# Altium project 新电磁.PrjPCB
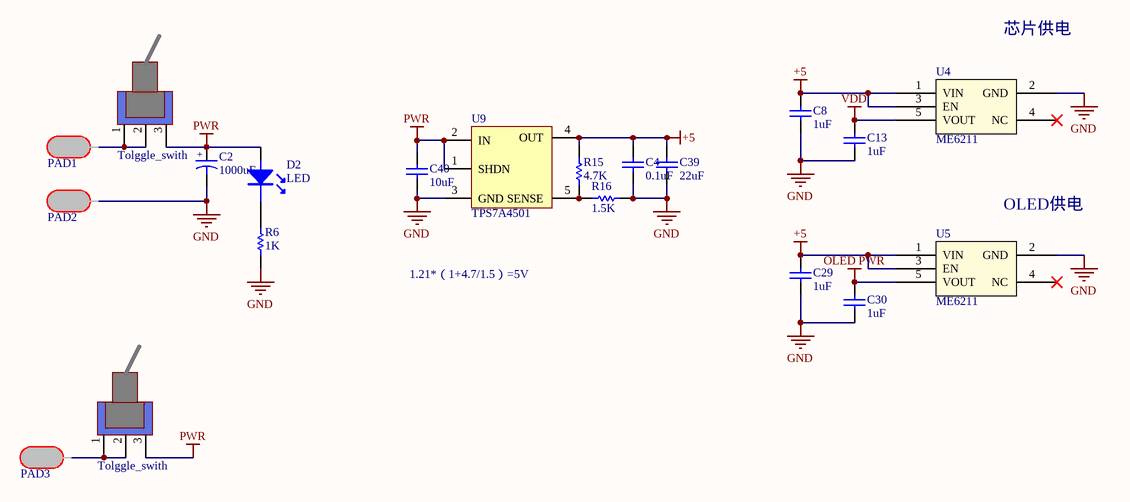
[diagram p0: 电源.SchDoc]
2 sheets, 43 parts. Net scope: global (net labels, ports and power ports of the same name join across sheets).
Board file: PCB1.PcbDoc
Sheets:
  电源.SchDoc
  外设.SchDoc

## Sheet 电源.SchDoc
size A4

### Parts
C2  1000uF  [CAP 10 x 12]
C4  0.1uF  [0603_C]
C8  1uF  [0805_c]
C13  1uF  [0805_c]
C29  1uF  [0805_c]
C30  1uF  [0805_c]
C39  22uF  [0805_c]
C40  10uF  [0805_c]
D2  LED  [0603_LED]
Energy1  Tolggle_swith  [TOGGLE SWICH STAND]
Energy2  Tolggle_swith  [TOGGLE SWICH STAND]
PAD1  PAD  [BIG PAD]  (value not drawn)
PAD2  PAD  [BIG PAD]  (value not drawn)
PAD3  PAD  [BIG PAD]  (value not drawn)
R6  1K  [R0603]
R15  4.7K  [R0603]
R16  1.5K  [R0603]
U4  ME6211  [SOT23-5]
U5  ME6211  [SOT23-5]
U9  TPS7A4501  [SOT-6]

### Nets
+5: C4.2 C8.2 C29.2 C39.2 R15.2 U4.1(VIN) U4.3(EN) U5.1(VIN) U5.3(EN) U9.4(OUT)
GND: C2.2 C4.1 C8.1 C13.1 C29.1 C30.1 C39.1 C40.1 PAD2.1 R6.1 R16.2 U4.2(GND) U5.2(GND) U9.3(GND)
OLED PWR: C30.2 U5.5(VOUT)
PWR: C2.1 C40.2 D2.1(A) Energy1.3 Energy2.3 U9.1(SHDN) U9.2(IN)
VDD: C13.2 U4.5(VOUT)
NetD2_2: D2.2(K) R6.2
NetEnergy1_1: Energy1.1 Energy1.2 PAD1.1
NetEnergy2_1: Energy2.1 Energy2.2 PAD3.1
NetR15_1: R15.1 R16.1 U9.5(SENSE)

Not connected (* = marked no-connect by the designer): U4 4(NC)*; U5 4(NC)*

### Notes on the sheet
- 芯片供电
- (near U5) OLED供电
- 1.21*（1+4.7/1.5）=5V
- (in symbol Cap_polar) +

### Library data of the parts
C2 = Cap_polar
C4 C8 C13 C29 C30 C39 C40 = CAP: Capacitor; Value: 104; Published: 8-Jun-2000; LatestRevisionDate: 17-Jul-2002; LatestRevisionNote: Re-released for DXP Platform.; PackageReference: RAD-0.3; Publisher: Altium Limited
D2 = LED: LED 发光二极管
R6 = RES: Resistor; Published: 8-Jun-2000; Revision: July-2002: Re-released for DXP Platform.; Publisher: Altium Limited; Value: 1K
R15 R16 = RES: Resistor; Value: 1K; Published: 8-Jun-2000; Revision: July-2002: Re-released for DXP Platform.; Publisher: Altium Limited
U4 U5 = ADP150AUJZ-1_8-R: 9uVRMS 150mA LDO; RefDes: RefDes; Type: Type; Value: Value
U9 = TL1963A

## Sheet 外设.SchDoc
size A4
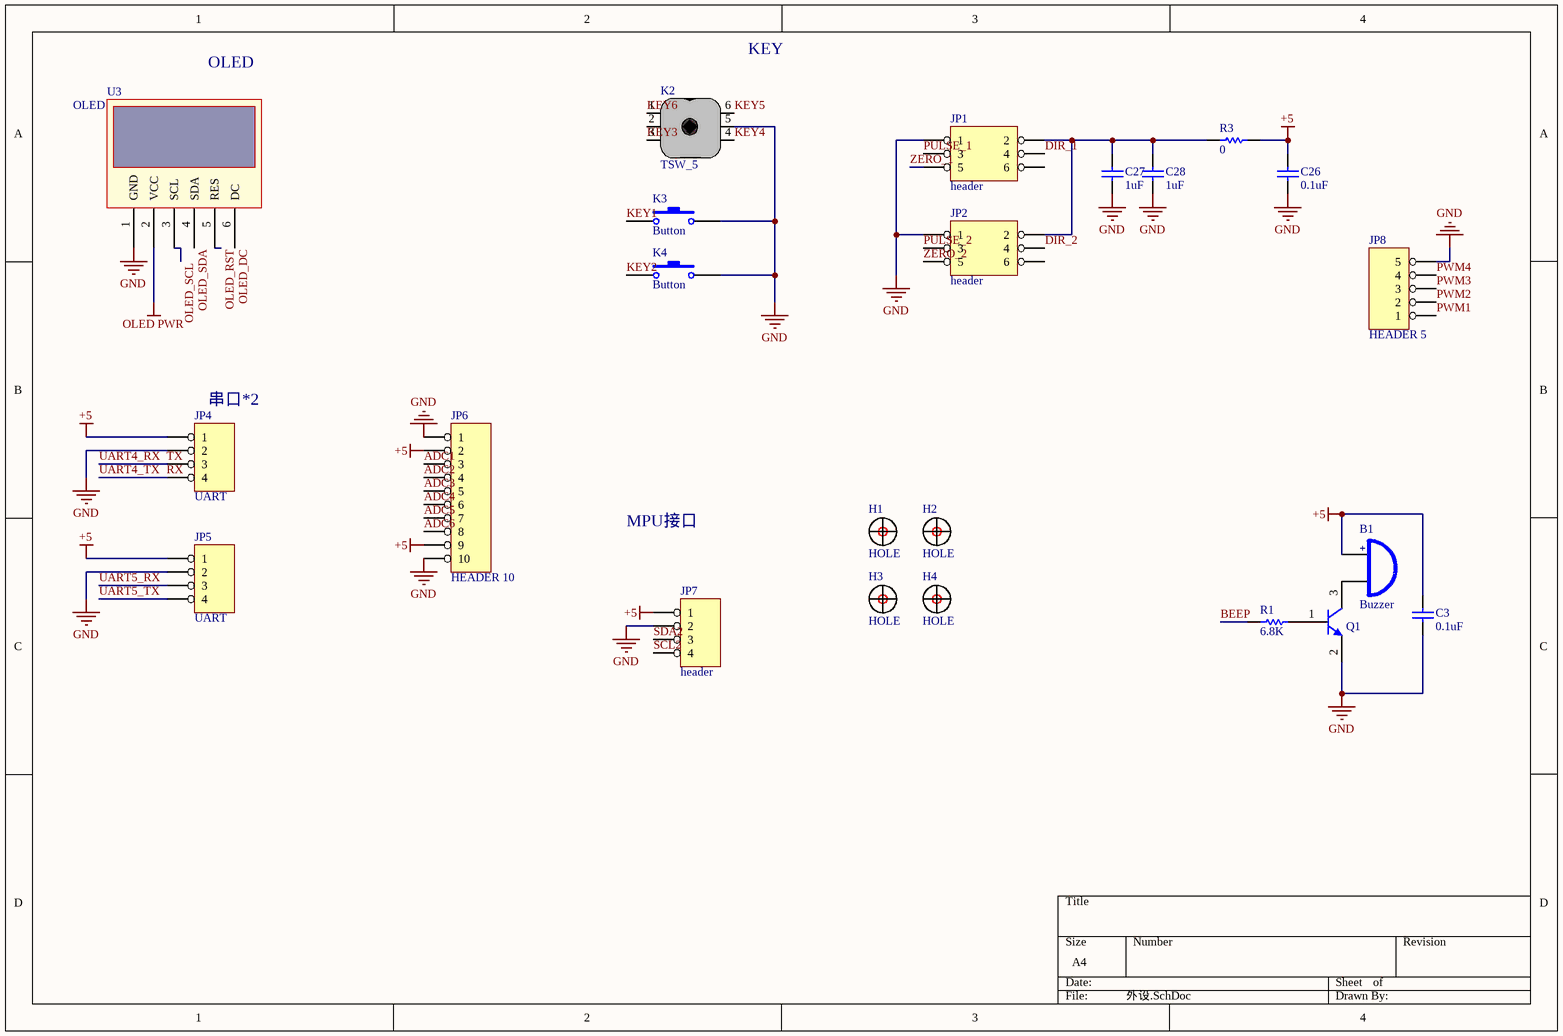
[diagram p1: 外设.SchDoc]

### Parts
B1  Buzzer  [BUZZ]
C3  0.1uF  [0603_C]
C26  0.1uF  [0805_c]
C27  1uF  [0805_c]
C28  1uF  [0805_c]
H1  HOLE  [定位孔 Φ3 1]
H2  HOLE  [定位孔 Φ3 1]
H3  HOLE  [定位孔 Φ3 1]
H4  HOLE  [定位孔 Φ3 1]
JP1  header  [header2X3]
JP2  header  [header2X3]
JP4  UART  [header4_M]
JP5  UART  [header4]
JP6  HEADER 10  [HEADER_10P_1.25_UP]
JP7  header  [header4]
JP8  HEADER 5  [HEADER_5P_1.25_RT]
K2  TSW_5  [TSW-10]
K3  Button  [button_2]
K4  Button  [button_2]
Q1  NPN2  [SOT-23-3]  (value not drawn)
R1  6.8K  [R0603]
R3  0  [R0603]
U3  OLED  [0.96寸OLED模块]

### Nets
+5: B1.1(A) C3.2 C26.2 JP4.1 JP5.1 JP6.2 JP6.9 JP7.1 R3.1
GND: C3.1 C26.1 C27.1 C28.1 JP1.1 JP2.1 JP4.2 JP5.2 JP6.1 JP6.10 JP7.2 JP8.5 K2.5 K3.2 K4.2 Q1.2(E) U3.1(GND)
OLED PWR: U3.2(VCC)
ADC1: JP6.3
ADC2: JP6.4
ADC3: JP6.5
ADC4: JP6.6
ADC5: JP6.7
ADC6: JP6.8
BEEP: R1.1
DIR_1: JP1.4
DIR_2: JP2.4
KEY1: K3.1
KEY2: K4.1
KEY3: K2.3
KEY4: K2.4
KEY5: K2.6
KEY6: K2.1
OLED_DC: U3.6(DC)
OLED_RST: U3.5(RES)
OLED_SCL: U3.3(SCL)
OLED_SDA: U3.4(SDA)
PULSE_1: JP1.3
PULSE_2: JP2.3
PWM1: JP8.1
PWM2: JP8.2
PWM3: JP8.3
PWM4: JP8.4
RX: JP4.4  [also labelled UART4_TX]
SCL2: JP7.4
SDA2: JP7.3
TX: JP4.3  [also labelled UART4_RX]
UART5_RX: JP5.3
UART5_TX: JP5.4
ZERO_1: JP1.5
ZERO_2: JP2.5
NetB1_2: B1.2(B) Q1.3(C)
NetC27_2: C27.2 C28.2 JP1.2 JP2.2 R3.2
NetQ1_1: Q1.1(B) R1.2

Not connected (* = marked no-connect by the designer): H1 1; H2 1; H3 1; H4 1; JP1 6; JP2 6; K2 2

### Notes on the sheet
- OLED
- KEY
- (near JP4) 串口*2
- MPU接口
- (in symbol Buzzer) +

### Library data of the parts
C3 C26-C28 = CAP: Capacitor; Value: 104; Published: 8-Jun-2000; LatestRevisionDate: 17-Jul-2002; LatestRevisionNote: Re-released for DXP Platform.; PackageReference: RAD-0.3; Publisher: Altium Limited
JP1 JP2 = HEADER 3X2
JP4 JP5 JP7 = HEADER 4
K2 = TSW_5: 方向开关
Q1 = NPN2: 贴片
R1 = RES
R3 = RES: Resistor; Value: 1K; Published: 8-Jun-2000; Revision: July-2002: Re-released for DXP Platform.; Publisher: Altium Limited
U3 = OLED: 模块
K3 K4 = Button: Published: 24-Mar-1999; LatestRevisionDate: 17-Jul-2002; LatestRevisionNote: Re-released for DXP Platform.; PackageReference: SPST-2; Publisher: Altium Limited

## Nets that join several sheets
+5: 电源 (10 pins), 外设 (9 pins)
GND: 电源 (14 pins), 外设 (17 pins)
OLED PWR: 电源 (C30.2 U5.5), 外设 (U3.2)